# Altium schematic sheet VGA Buddy PCB.SchDoc
size A
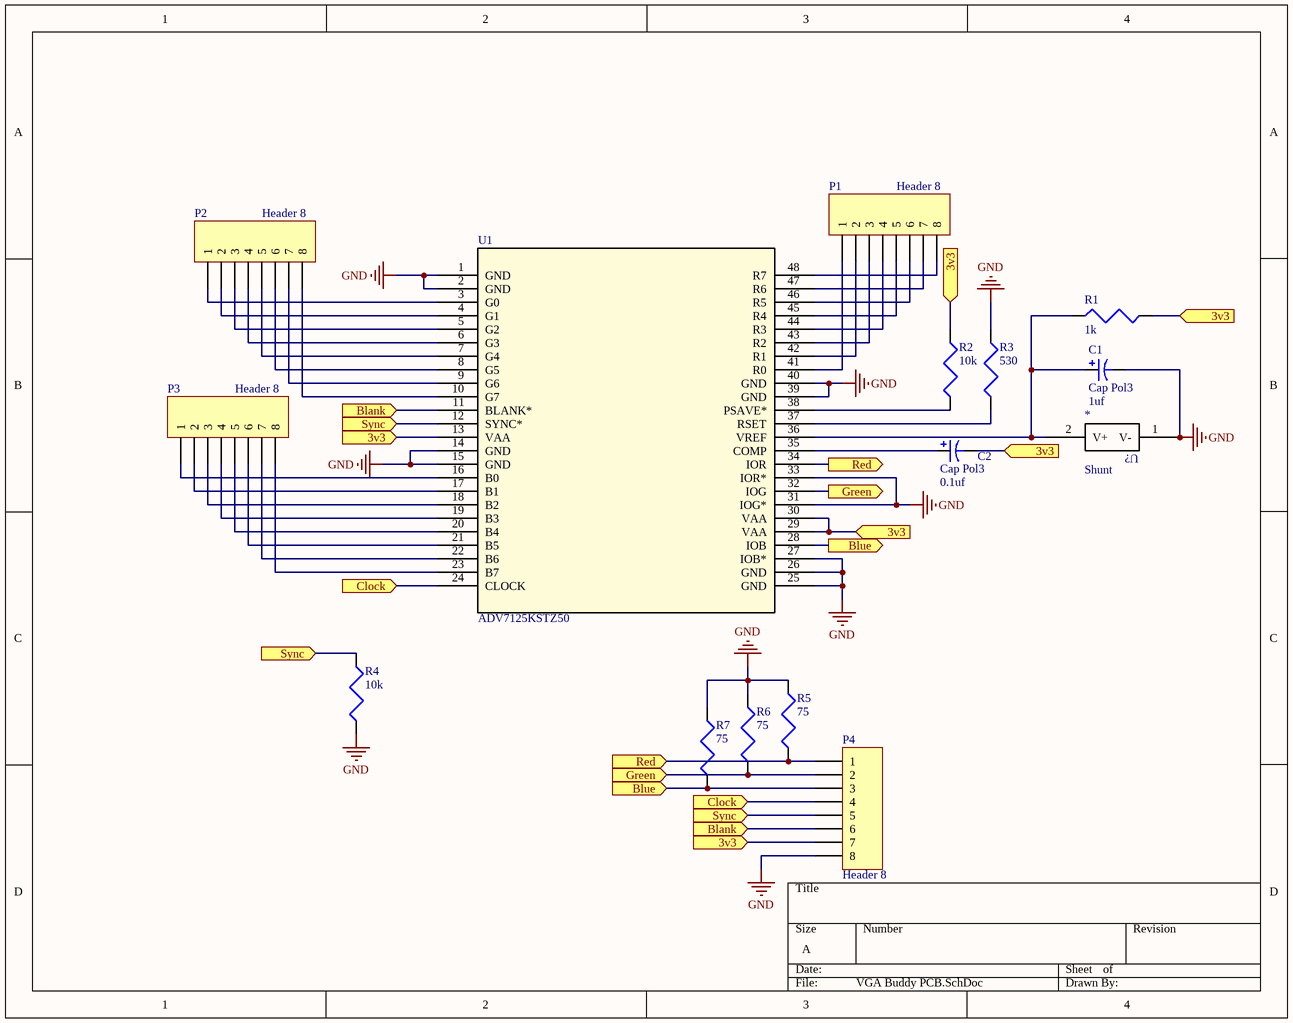
[diagram p0: VGA Buddy PCB.SchDoc]

## Parts
*  Shunt  [SOT95P245X110-3N]
C1  Cap Pol3  value 1uf  [C0805]
C2  Cap Pol3  value 0.1uf  [C0805]
P1  Header 8  [HDR1X8]
P2  Header 8  [HDR1X8]
P3  Header 8  [HDR1X8]
P4  Header 8  [HDR1X8]
R1  1k  [805]
R2  10k  [805]
R3  530  [805]
R4  10k  [805]
R5  75  [805]
R6  75  [805]
R7  75  [805]
U1  ADV7125KSTZ50  [ST_48_ADI]

## Ports
3v3 (in), Blank (in), Blue (in), Blue (out), Clock (in), Green (in), Green (out), Red (in), Red (out), Sync (in)

## Nets
GND: *.1(V-) C1.2 P4.8 R3.2 R4.1 R5.2 R6.2 R7.2 U1.1(GND) U1.2(GND) U1.14(GND) U1.15(GND) U1.25(GND) U1.26(GND) U1.27(IOB*) U1.31(IOG*) U1.33(IOR*) U1.39(GND) U1.40(GND)
3v3: C2.2 P4.7 R1.2 R2.2 U1.13(VAA) U1.29(VAA) U1.30(VAA) ; port 3v3
Blank: P4.6 U1.11(BLANK*) ; port Blank
Blue: P4.3 R7.1 U1.28(IOB) ; port Blue
Clock: P4.4 U1.24(CLOCK) ; port Clock
Green: P4.2 R6.1 U1.32(IOG) ; port Green
Red: P4.1 R5.1 U1.34(IOR) ; port Red
Sync: P4.5 R4.2 U1.12(SYNC*) ; port Sync
Net*_2: *.2(V+) C1.1 R1.1 U1.36(VREF)
NetC2_1: C2.1 U1.35(COMP)
NetP1_1: P1.1 U1.41(R0)
NetP1_2: P1.2 U1.42(R1)
NetP1_3: P1.3 U1.43(R2)
NetP1_4: P1.4 U1.44(R3)
NetP1_5: P1.5 U1.45(R4)
NetP1_6: P1.6 U1.46(R5)
NetP1_7: P1.7 U1.47(R6)
NetP1_8: P1.8 U1.48(R7)
NetP2_1: P2.1 U1.3(G0)
NetP2_2: P2.2 U1.4(G1)
NetP2_3: P2.3 U1.5(G2)
NetP2_4: P2.4 U1.6(G3)
NetP2_5: P2.5 U1.7(G4)
NetP2_6: P2.6 U1.8(G5)
NetP2_7: P2.7 U1.9(G6)
NetP2_8: P2.8 U1.10(G7)
NetP3_1: P3.1 U1.16(B0)
NetP3_2: P3.2 U1.17(B1)
NetP3_3: P3.3 U1.18(B2)
NetP3_4: P3.4 U1.19(B3)
NetP3_5: P3.5 U1.20(B4)
NetP3_6: P3.6 U1.21(B5)
NetP3_7: P3.7 U1.22(B6)
NetP3_8: P3.8 U1.23(B7)
NetR2_1: R2.1 U1.38(PSAVE*)
NetR3_1: R3.1 U1.37(RSET)

## Notes on the sheet
- (in symbol Shunt) U?

## Library data of the parts
C1 C2 = Cap Pol3: Polarized Capacitor (Surface Mount); Published: 8-Jun-2000; LatestRevisionDate: 29-May-2009; LatestRevisionNote: IPC-7351 Footprint Added.; PackageReference: C0805; Publisher: Altium Limited; PackageDescription: Chip Capacitor
P1-P4 = Header 8: Header, 8-Pin; LatestRevisionDate: 17-Jul-2002; LatestRevisionNote: Re-released for DXP Platform.; Publisher: Altium Limited
R2-R7 = 1k
U1 = ADV7125KSTZ50: No Description Available; Vendor: Analog Devices Inc; Built_By: EMA_UL_Team; SourceLibrary: Analog_2012-01-01_8; Manufacturer_Part_Number: ADV7125KSTZ50; Copyright: Copyright (C) 2018 Accelerated Designs. All rights reserved; RefDes: RefDes; Type: DEV